# EAGLE design Spannungsversorgung (EAGLE 6.6.0)
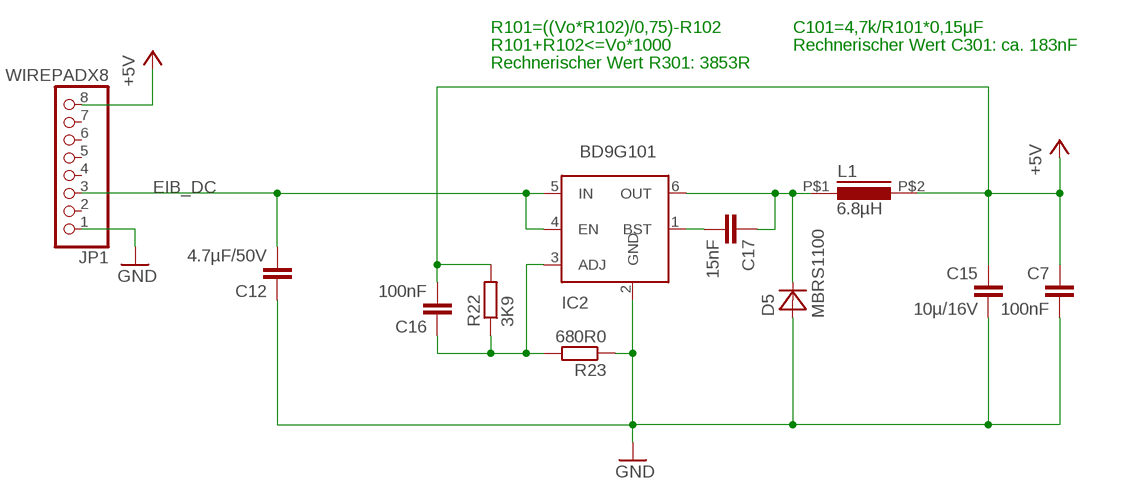
[diagram p0: schematic, sheet 1]

## Parts
C7  100nF  C-EUC1206  [C1206]
C12  4.7µF/50V  C-EUC1206  [C1206]
C15  10µ/16V  C-EUC1206  [C1206]
C16  100nF  C-EUC1206  [C1206]
C17  15nF  C-EUC1206  [C1206]
D5  MBRS1100  MBRA340T3  [SMA]
IC2  BD9G101  BD9G101GBD9G101G-SOT23-6  [SOT23-6]
JP1  WIREPADX8  [SMD1,27X2,54X8]
L1  6.8µH  IND_FASTRON_1616FPS  [PIS2812]
R22  3K9  R-EU_R1206  [R1206]
R23  680R0  R-EU_R1206  [R1206]

## Nets
+5V: C7.1 C15.1 C16.2 JP1.8 L1.P$2 R22.2
EIB_DC: C12.2 IC2.4(EN) IC2.5(IN) JP1.3
GND: C7.2 C12.1 C15.2 D5.A IC2.2(GND) JP1.1 R23.1
LX1: C17.1 D5.C IC2.6(OUT) L1.P$1
N$1: C17.2 IC2.1(BST)
N$3: C16.1 IC2.3(ADJ) R22.1 R23.2
Unconnected: JP1.2 JP1.4 JP1.5 JP1.6 JP1.7

## Notes on the sheet
- R101=((Vo*R102)/0,75)-R102 | C101=4,7k/R101*0,15µF
- R101+R102<=Vo*1000 | Rechnerischer Wert C301: ca. 183nF
- Rechnerischer Wert R301: 3853R

## Library data of the parts
C7 = rcl:C-EU: CAPACITOR, European symbol; REICHELT: X7R-G1206 100N
C12 = rcl:C-EU: CAPACITOR, European symbol; REICHELT: X7R-G1206 4,7/50
C15 = rcl:C-EU: CAPACITOR, European symbol; REICHELT: X7R-G1206 22/10
C16 = rcl:C-EU: CAPACITOR, European symbol; REICHELT: KEM X7R1206 220N
C17 = rcl:C-EU: CAPACITOR, European symbol; REICHELT: X7R-G1206 15N
D5 = diode:MBRA340T3: Surface Mount Schottky Power Rectifier Source: http://www.onsemi.com/pub_link/Collateral/MBRA340T3-D.PDF; REICHELT: MBRS 1100 SMD
IC2 = Stefan_selfbus:BD9G101G; DIGI-KEY: BD9G101G-CT-ND
JP1 = selfbus:WIREPADX8
L1 = Stefan_selfbus:IND_FASTRON_1616FPS; REICHELT: L-1616FPS 6,8µ
R22 = rcl:R-EU_: RESISTOR, European symbol; REICHELT: RND 1206 1 3,9K
R23 = rcl:R-EU_: RESISTOR, European symbol; REICHELT: SMD 1/4W 680

## Board
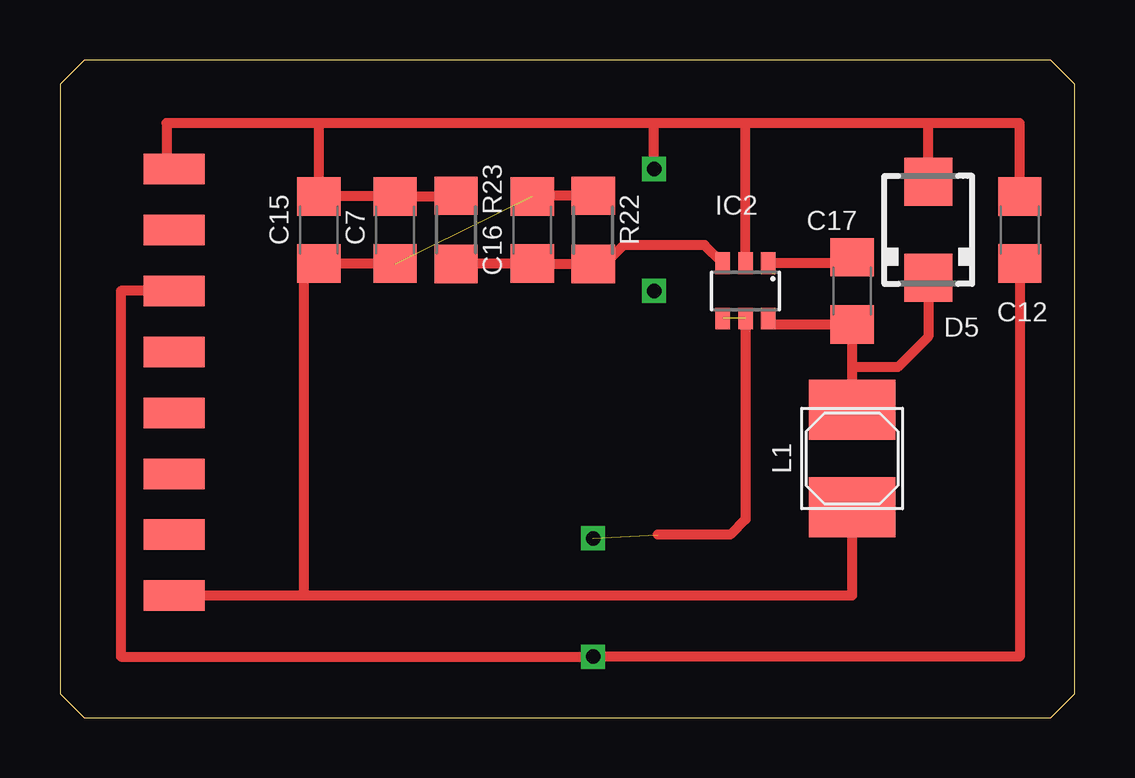
[diagram p1: board, top side]
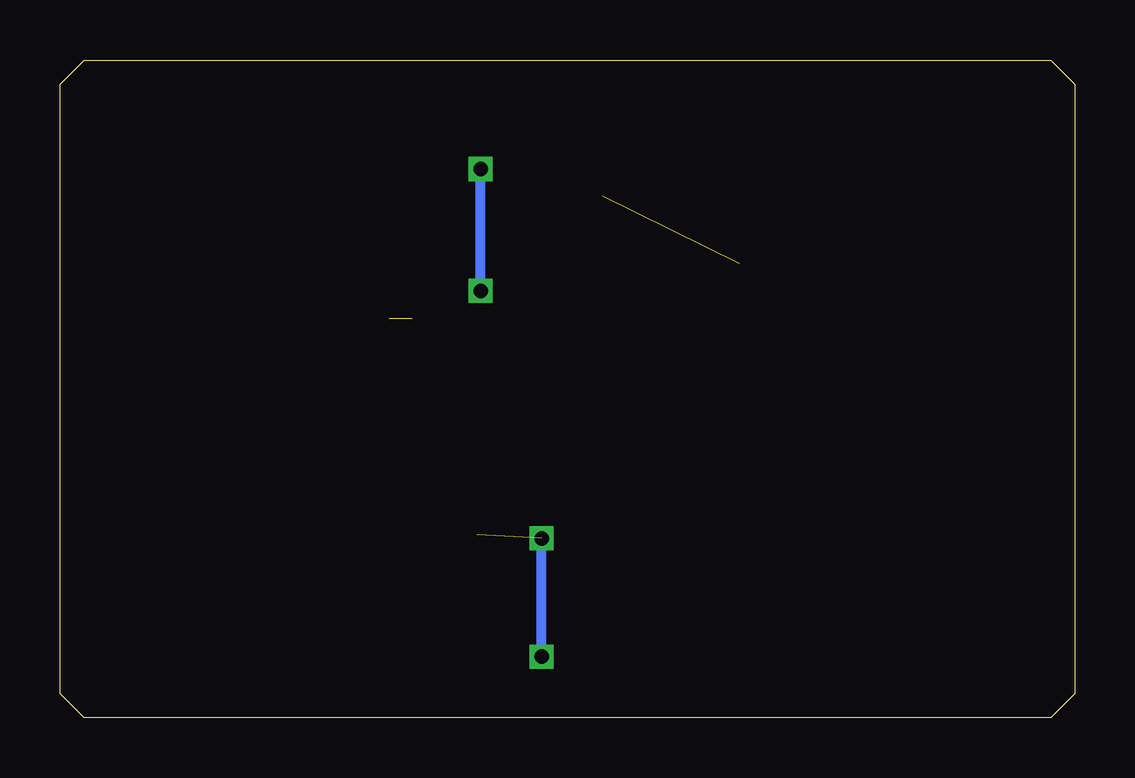
[diagram p2: board, bottom side, seen from below]

Size 42.3 x 27.4 mm. Coordinates in mm from the lower left corner, seen from the top.
Outline: 0,1 1,0 41.3,0 42.3,1 42.3,26.4 41.3,27.4 1,27.4 0,26.4 0,1
Copper layers (1*16): Top 0.035mm / dielectric 1.5mm / Bottom 0.035mm
Design rules "default": minimum track width 10mil, minimum drill 24mil, track to track 8mil, track to pad 8mil, pad to pad 8mil, via to via 8mil, smd to smd 8mil, copper to edge 40mil, drill to drill 8mil, minimum pad ring 10mil, minimum via ring 8mil, stop-mask expansion 4mil, vias tented up to drill 0mil, thermal gap 10mil

### Footprints (pad centres in the part's own frame; a part is rotated, then mirrored left to right if it is on the bottom)
C1206 = smd 1.6 x 1.8: 1 -1.4,0; 2 1.4,0
SMA = smd 2 x 2: A 2,0; C -2,0
SOT23-6 = smd 0.6 x 0.9: 1 -0.95,-1.15; 2 0,-1.15; 3 0.95,-1.15; 4 0.95,1.15; 5 0,1.15; 6 -0.95,1.15
SMD1,27X2,54X8 = smd 2.54 x 1.27: 1 0,8.89; 2 0,6.35; 3 0,3.81; 4 0,1.27; 5 0,-1.27; 6 0,-3.81; 7 0,-6.35; 8 0,-8.89
PIS2812 = smd 3.6 x 2.5: P$1 0,2.025; P$2 0,-2.025
R1206 = smd 1.6 x 1.803: 1 -1.422,0; 2 1.422,0

### Placement (x,y rotation side)
C7  13.97,20.32 90 top
C12  40.01,20.32 270 top
C15  10.79,20.32 90 top
C16  19.68,20.32 90 top
C17  33.02,17.78 90 top
D5  36.2,20.32 90 top
IC2  28.57,17.78 180 top
JP1  4.76,13.97 0 top
L1  33.02,10.79 0 top
R22  22.23,20.32 90 top
R23  16.51,20.32 270 top

### Tracks (layer width: path | path; a pad name or v marks a point on that pad's centre or on a via)
+5V  (1 unrouted)
  Top 0.406: L1.P$2 33.02,5.08 10.16,5.08 | 10.16,5.08 JP1.8 | 10.16,5.08 10.16,18.29 C15.1 C7.1 | R22.2 19.68,21.74 C16.2
EIB_DC  (via drill 0.6)  (2 unrouted)
  Top 0.406: C12.2 40.01,2.54 v22.23,2.54 2.54,2.54 2.54,17.78 JP1.3 | IC2.5 28.57,8.26 27.94,7.62 24.92,7.62
  Bottom 0.406: v22.23,2.54 v22.23,7.47
GND  (via drill 0.6)
  Top 0.406: C12.1 40.01,24.77 36.2,24.77 | 36.2,24.77 28.57,24.77 | 28.57,24.77 24.77,24.77 | 24.77,24.77 10.79,24.77 | 10.79,24.77 4.45,24.77 4.45,22.86 JP1.1 | 10.79,24.77 C15.2 C7.2 16.49,21.72 R23.1 | D5.A 36.2,24.77 | v24.77,22.86 24.77,24.77 | IC2.2 28.57,24.77
  Bottom 0.406: v24.77,17.78 v24.77,22.86
LX1
  Top 0.406: 36.2,18.92 D5.C 36.2,15.88 34.92,14.61 33.02,14.61 | IC2.6 29.52,16.38 C17.1 33.02,14.61 | 33.02,14.61 L1.P$1
N$1
  Top 0.406: C17.2 33.02,18.93 IC2.1
N$3
  Top 0.406: IC2.3 26.87,19.68 23.5,19.68 22.86,19.05 22.38,19.05 R22.1 19.71,18.9 C16.1 16.53,18.92 R23.2